# Altium schematic sheet POWER2.SchDoc
size A3
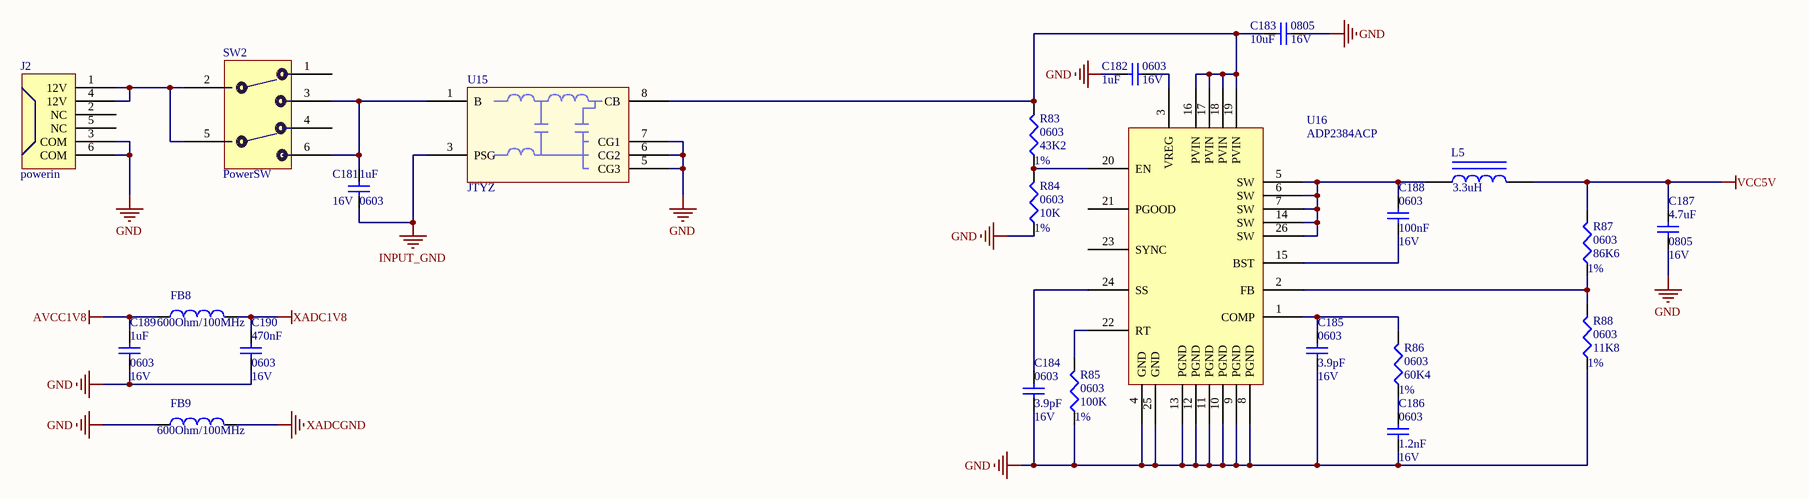
[diagram p0: POWER2.SchDoc]

## Parts
C181  PackageReference: 0603  V: 16V  [1608[0603]]  (hidden comment: 1uF)
C182  PackageReference: 0603  V: 16V  [1608[0603]]  (hidden comment: 1uF)
C183  PackageReference: 0805  V: 16V  [2012[0805]]  (hidden comment: 10uF)
C184  PackageReference: 0603  V: 16V  [1608[0603]]  (hidden comment: 3.9pF)
C185  PackageReference: 0603  V: 16V  [1608[0603]]  (hidden comment: 3.9pF)
C186  PackageReference: 0603  V: 16V  [1608[0603]]  (hidden comment: 1.2nF)
C187  PackageReference: 0805  V: 16V  [2012[0805]]  (hidden comment: 4.7uF)
C188  PackageReference: 0603  V: 16V  [1608[0603]]  (hidden comment: 100nF)
C189  PackageReference: 0603  V: 16V  [1608[0603]]  (hidden comment: 1uF)
C190  PackageReference: 0603  V: 16V  [1608[0603]]  (hidden comment: 470nF)
FB8  600Ohm/100MHz  [2012[0805]]
FB9  600Ohm/100MHz  [2012[0805]]
J2  powerin  [POWER2X3]
L5  value 3.3uH  [SRN4018]  (hidden comment: Inductor Iron)
R83  value 43K2  PackageReference: 0603  AC: 1%  [1608[0603]]  (hidden comment: Res3)
R84  value 10K  PackageReference: 0603  AC: 1%  [1608[0603]]  (hidden comment: Res3)
R85  value 100K  PackageReference: 0603  AC: 1%  [1608[0603]]  (hidden comment: Res3)
R86  value 60K4  PackageReference: 0603  AC: 1%  [1608[0603]]  (hidden comment: Res3)
R87  value 86K6  PackageReference: 0603  AC: 1%  [1608[0603]]  (hidden comment: Res3)
R88  value 11K8  PackageReference: 0603  AC: 1%  [1608[0603]]  (hidden comment: Res3)
SW2  PowerSW  [Power_SW]
U15  JTYZ  [JTYZ]
U16  ADP2384ACP  [ADP2384]

## Nets
AVCC1V8: C189.1 FB8.1
GND: C182.2 C183.2 C184.1 C185.1 C186.1 C187.2 C189.2 C190.2 FB9.1 J2.3(COM) J2.6(COM) R84.1 R85.1 R88.1 U15.5(CG3) U15.6(CG2) U15.7(CG1) U16.4(GND) U16.8(PGND) U16.9(PGND) U16.10(PGND) U16.11(PGND) U16.12(PGND) U16.13(PGND) U16.25(GND)
INPUT_GND: C181.2 U15.3(PSG)
VCC5V: C187.1 L5.2 R87.2
XADC1V8: C190.1 FB8.2
XADCGND: FB9.2
NetC181_1: C181.1 SW2.3 SW2.6 U15.1(B)
NetC182_1: C182.1 U16.3(VREG)
NetC183_1: C183.1 R83.2 U15.8(CB) U16.16(PVIN) U16.17(PVIN) U16.18(PVIN) U16.19(PVIN)
NetC184_2: C184.2 U16.24(SS)
NetC185_2: C185.2 R86.2 U16.1(COMP)
NetC186_2: C186.2 R86.1
NetC188_1: C188.1 U16.15(BST)
NetC188_2: C188.2 L5.1 U16.5(SW) U16.6(SW) U16.7(SW) U16.14(SW) U16.26(SW)
NetJ2_1: J2.1(12V) J2.4(12V) SW2.2 SW2.5
NetR83_1: R83.1 R84.2 U16.20(EN)
NetR85_2: R85.2 U16.22(RT)
NetR87_1: R87.1 R88.2 U16.2(FB)

Not connected (* = marked no-connect by the designer): J2 2(NC) 5(NC); SW2 1 4; U16 21(PGOOD) 23(SYNC)

## Library data of the parts
C181-C190 = Cap Semi: Capacitor (Semiconductor SIM Model); LatestRevisionDate: 17-Jul-2002; LatestRevisionNote: Re-released for DXP Platform.; Publisher: Altium Limited
  C181 C182 C189: Value: 1uF
  C183: Value: 10uF
  C184 C185: Value: 3.9pF
  C186: Value: 1.2nF
  C187: Value: 4.7uF
  C188: Value: 100nF
  C190: Value: 470nF
FB8 FB9 = Inductor: Value: 600Ohm/100MHz
L5 = Inductor Iron: Magnetic-Core Inductor; Published: 24-Mar-1999; LatestRevisionDate: 17-Jul-2002; LatestRevisionNote: Re-released for DXP Platform.; PackageReference: AXIAL-0.9; Publisher: Altium Limited
R83-R88 = Res3: Resistor; Published: 8-Jun-2000; LatestRevisionDate: 29-May-2009; LatestRevisionNote: IPC-7351 Footprint Added.; Publisher: Altium Limited; PackageDescription: Chip Resistor